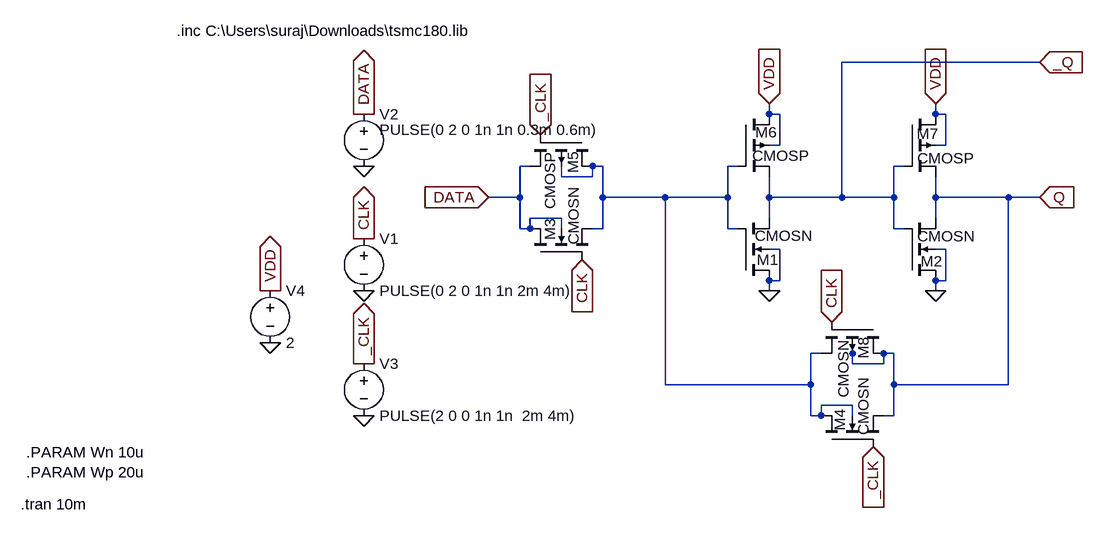
[diagram p0: schematic D_Latch.asc]
D_Latch.asc, the LTspice schematic file:
Version 4
SHEET 1 880 680
WIRE 544 -112 240 -112
WIRE 128 -32 128 -48
WIRE 144 -32 128 -32
WIRE 384 -32 384 -48
WIRE 400 -32 384 -32
WIRE 128 -16 128 -32
WIRE 384 -16 384 -32
WIRE 144 16 144 -32
WIRE 144 16 128 16
WIRE 400 16 400 -32
WIRE 400 16 384 16
WIRE -240 48 -256 48
WIRE -128 48 -144 48
WIRE 80 48 64 48
WIRE 336 48 320 48
WIRE -192 64 -192 48
WIRE -144 64 -144 48
WIRE -144 64 -192 64
WIRE -256 96 -256 48
WIRE -256 96 -304 96
WIRE -128 96 -128 48
WIRE -32 96 -128 96
WIRE 64 96 64 48
WIRE 64 96 -32 96
WIRE 128 96 128 64
WIRE 240 96 240 -112
WIRE 240 96 128 96
WIRE 320 96 320 48
WIRE 320 96 240 96
WIRE 384 96 384 64
WIRE 496 96 384 96
WIRE 544 96 496 96
WIRE -192 128 -240 128
WIRE 128 128 128 96
WIRE 384 128 384 96
WIRE -256 144 -256 96
WIRE -240 144 -240 128
WIRE -240 144 -256 144
WIRE -192 144 -192 128
WIRE -128 144 -128 96
WIRE -128 144 -144 144
WIRE 64 144 64 96
WIRE 80 144 64 144
WIRE 320 144 320 96
WIRE 336 144 320 144
WIRE 144 176 128 176
WIRE 400 176 384 176
WIRE 144 224 144 176
WIRE 144 224 128 224
WIRE 384 224 384 208
WIRE 400 224 400 176
WIRE 400 224 384 224
WIRE 128 240 128 224
WIRE 384 240 384 224
WIRE 208 336 192 336
WIRE 256 336 256 320
WIRE 320 336 304 336
WIRE 256 352 256 336
WIRE 304 352 304 336
WIRE 304 352 256 352
WIRE -32 384 -32 96
WIRE 192 384 192 336
WIRE 192 384 -32 384
WIRE 320 384 320 336
WIRE 496 384 496 96
WIRE 496 384 320 384
WIRE 256 416 208 416
WIRE 192 432 192 384
WIRE 208 432 208 416
WIRE 208 432 192 432
WIRE 256 432 256 416
WIRE 320 432 320 384
WIRE 320 432 304 432
FLAG 384 240 0
FLAG 128 240 0
FLAG 128 -48 VDD
IOPIN 128 -48 In
FLAG 384 -48 VDD
IOPIN 384 -48 In
FLAG -304 96 DATA
IOPIN -304 96 In
FLAG 544 -112 _Q
IOPIN 544 -112 In
FLAG 544 96 Q
IOPIN 544 96 In
FLAG 288 480 _CLK
IOPIN 288 480 In
FLAG 224 288 CLK
IOPIN 224 288 In
FLAG -160 192 CLK
IOPIN -160 192 In
FLAG -224 0 _CLK
IOPIN -224 0 In
FLAG -496 240 0
FLAG -496 48 0
FLAG -496 -32 DATA
IOPIN -496 -32 Out
FLAG -496 160 CLK
IOPIN -496 160 Out
FLAG -496 352 _CLK
IOPIN -496 352 Out
FLAG -496 432 0
FLAG -640 320 0
FLAG -640 240 VDD
IOPIN -640 240 Out
SYMBOL nmos4 80 224 M180
WINDOW 0 29 32 Left 2
WINDOW 3 26 69 Left 2
SYMATTR InstName M1
SYMATTR Value CMOSN
SYMATTR Value2 l=0.18u w=Wn
SYMBOL nmos4 336 224 M180
WINDOW 0 25 30 Left 2
WINDOW 3 20 68 Left 2
SYMATTR InstName M2
SYMATTR Value CMOSN
SYMATTR Value2 l=0.18u w=Wn
SYMBOL nmos4 -240 192 R270
WINDOW 0 29 31 Left 2
WINDOW 3 23 67 Left 2
SYMATTR InstName M3
SYMATTR Value CMOSN
SYMATTR Value2 l=0.18u w=Wn
SYMBOL nmos4 208 480 R270
WINDOW 0 24 29 Left 2
WINDOW 3 18 65 Left 2
SYMATTR InstName M4
SYMATTR Value CMOSN
SYMATTR Value2 l=0.18u w=Wn
SYMBOL pmos4 -144 0 R90
WINDOW 0 26 30 Left 2
WINDOW 3 27 65 Left 2
SYMATTR InstName M5
SYMATTR Value CMOSP
SYMATTR Value2 l=0.18u w=Wp
SYMBOL pmos4 80 -32 R0
WINDOW 0 27 28 Left 2
WINDOW 3 22 64 Left 2
SYMATTR InstName M6
SYMATTR Value CMOSP
SYMATTR Value2 l=0.18u w=Wp
SYMBOL pmos4 336 -32 R0
WINDOW 0 19 30 Left 2
WINDOW 3 20 68 Left 2
SYMATTR InstName M7
SYMATTR Value CMOSP
SYMATTR Value2 l=0.18u w=Wp
SYMBOL pmos4 304 288 R90
WINDOW 0 23 31 Left 2
WINDOW 3 27 62 Left 2
SYMATTR InstName M8
SYMATTR Value CMOSN
SYMATTR Value2 l=0.18u w=Wp
SYMBOL voltage -496 144 R0
WINDOW 123 0 0 Left 0
WINDOW 39 0 0 Left 0
SYMATTR InstName V1
SYMATTR Value PULSE(0 2 0 1n 1n 2m 4m)
SYMBOL voltage -496 -48 R0
WINDOW 3 24 40 Left 2
WINDOW 123 0 0 Left 0
WINDOW 39 0 0 Left 0
SYMATTR Value PULSE(0 2 0 1n 1n 0.3m 0.6m)
SYMATTR InstName V2
SYMBOL voltage -496 336 R0
WINDOW 123 0 0 Left 0
WINDOW 39 0 0 Left 0
SYMATTR InstName V3
SYMATTR Value PULSE(2 0 0 1n 1n  2m 4m)
SYMBOL voltage -640 224 R0
WINDOW 123 0 0 Left 0
WINDOW 39 0 0 Left 0
SYMATTR InstName V4
SYMATTR Value 2
TEXT -784 -160 Left 2 !.inc C:\\Users\\suraj\\Downloads\\tsmc180.lib
TEXT -1024 568 Left 2 !.tran 10m
TEXT -1016 488 Left 2 !.PARAM Wn 10u\n.PARAM Wp 20u

The netlist it stands for:
* D_Latch.asc
M1 0 N001 _Q 0 CMOSN l=0.18u w=Wn
M2 0 _Q Q 0 CMOSN l=0.18u w=Wn
M3 DATA CLK N001 DATA CMOSN l=0.18u w=Wn
M4 N001 _CLK Q N001 CMOSN l=0.18u w=Wn
M5 N001 _CLK DATA N001 CMOSP l=0.18u w=Wp
M6 VDD N001 _Q VDD CMOSP l=0.18u w=Wp
M7 VDD _Q Q VDD CMOSP l=0.18u w=Wp
M8 Q CLK N001 Q CMOSN l=0.18u w=Wp
V1 CLK 0 PULSE(0 2 0 1n 1n 2m 4m)
V2 DATA 0 PULSE(0 2 0 1n 1n 0.3m 0.6m)
V3 _CLK 0 PULSE(2 0 0 1n 1n  2m 4m)
V4 VDD 0 2
.model NMOS NMOS
.model PMOS PMOS
.lib standard.mos
.inc C:\Users\suraj\Downloads\tsmc180.lib
.tran 10m
.PARAM Wn 10u
.PARAM Wp 20u
.backanno
.end